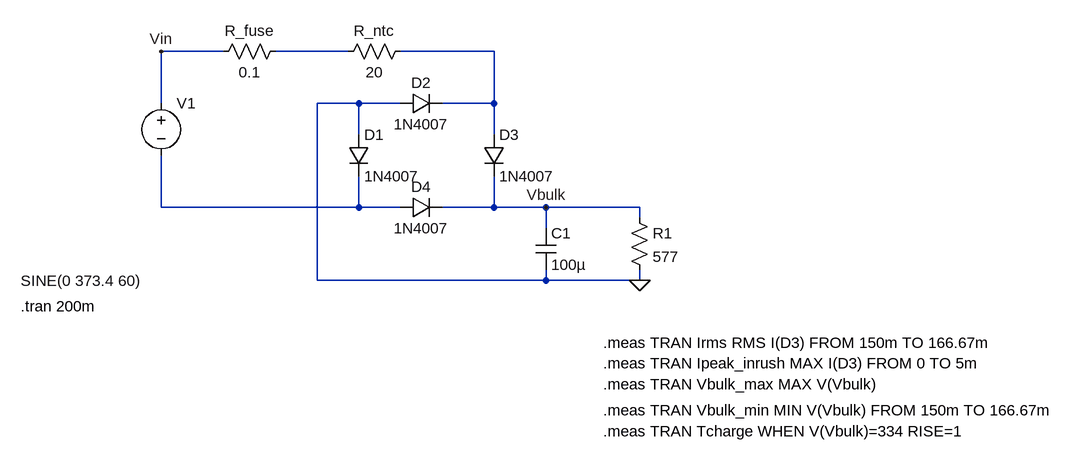
[diagram p0: schematic bridgerectifier.asc]
bridgerectifier.asc, the LTspice schematic file:
Version 4.1
SHEET 1 2832 696
WIRE -192 -64 -288 -64
WIRE 0 -64 -112 -64
WIRE 224 -64 80 -64
WIRE -288 16 -288 -64
WIRE 16 16 -48 16
WIRE 80 16 16 16
WIRE 224 16 224 -64
WIRE 224 16 144 16
WIRE 16 64 16 16
WIRE 224 64 224 16
WIRE -288 176 -288 96
WIRE 16 176 16 128
WIRE 16 176 -288 176
WIRE 80 176 16 176
WIRE 224 176 224 128
WIRE 224 176 144 176
WIRE 304 176 224 176
WIRE 448 176 304 176
WIRE 448 192 448 176
WIRE 304 208 304 176
WIRE -48 288 -48 16
WIRE 304 288 304 272
WIRE 304 288 -48 288
WIRE 448 288 448 272
WIRE 448 288 304 288
FLAG -288 -64 Vin
FLAG 304 176 Vbulk
FLAG 448 288 0
SYMBOL diode 0 64 R0
SYMATTR InstName D1
SYMATTR Value 1N4007
SYMBOL diode 80 32 R270
WINDOW 0 32 32 VTop 2
WINDOW 3 0 32 VBottom 2
SYMATTR InstName D2
SYMATTR Value 1N4007
SYMBOL diode 208 64 R0
SYMATTR InstName D3
SYMATTR Value 1N4007
SYMBOL diode 80 192 R270
WINDOW 0 32 32 VTop 2
WINDOW 3 0 32 VBottom 2
SYMATTR InstName D4
SYMATTR Value 1N4007
SYMBOL voltage -288 0 R0
WINDOW 123 0 0 Left 0
WINDOW 39 0 0 Left 0
WINDOW 3 -216 289 Left 2
SYMATTR InstName V1
SYMATTR Value SINE(0 373.4 60)
SYMBOL res 432 176 R0
SYMATTR InstName R1
SYMATTR Value 577
SYMBOL cap 288 208 R0
SYMATTR InstName C1
SYMATTR Value 100µ
SYMBOL res -96 -80 R90
WINDOW 0 0 56 VBottom 2
WINDOW 3 32 56 VTop 2
SYMATTR InstName R_fuse
SYMATTR Value 0.1
SYMBOL res 96 -80 R90
WINDOW 0 0 56 VBottom 2
WINDOW 3 32 56 VTop 2
SYMATTR InstName R_ntc
SYMATTR Value 20
TEXT -504 328 Left 2 !.tran 200m
TEXT 392 384 Left 2 !.meas TRAN Irms RMS I(D3) FROM 150m TO 166.67m
TEXT 392 416 Left 2 !.meas TRAN Ipeak_inrush MAX I(D3) FROM 0 TO 5m
TEXT 392 448 Left 2 !.meas TRAN Vbulk_max MAX V(Vbulk)
TEXT 392 488 Left 2 !.meas TRAN Vbulk_min MIN V(Vbulk) FROM 150m TO 166.67m
TEXT 392 520 Left 2 !.meas TRAN Tcharge WHEN V(Vbulk)=334 RISE=1

The netlist it stands for:
* bridgerectifier.asc
D1 0 N003 1N4007
D2 0 N002 1N4007
D3 N002 Vbulk 1N4007
D4 N003 Vbulk 1N4007
V1 Vin N003 SINE(0 373.4 60)
R1 Vbulk 0 577
C1 Vbulk 0 100µ
R_fuse N001 Vin 0.1
R_ntc N002 N001 20
.model D D
.lib standard.dio
.tran 200m
.meas TRAN Irms RMS I(D3) FROM 150m TO 166.67m
.meas TRAN Ipeak_inrush MAX I(D3) FROM 0 TO 5m
.meas TRAN Vbulk_max MAX V(Vbulk)
.meas TRAN Vbulk_min MIN V(Vbulk) FROM 150m TO 166.67m
.meas TRAN Tcharge WHEN V(Vbulk)=334 RISE=1
.backanno
.end